# EAGLE board logmega (EAGLE 6.5.0), part 1 of 2
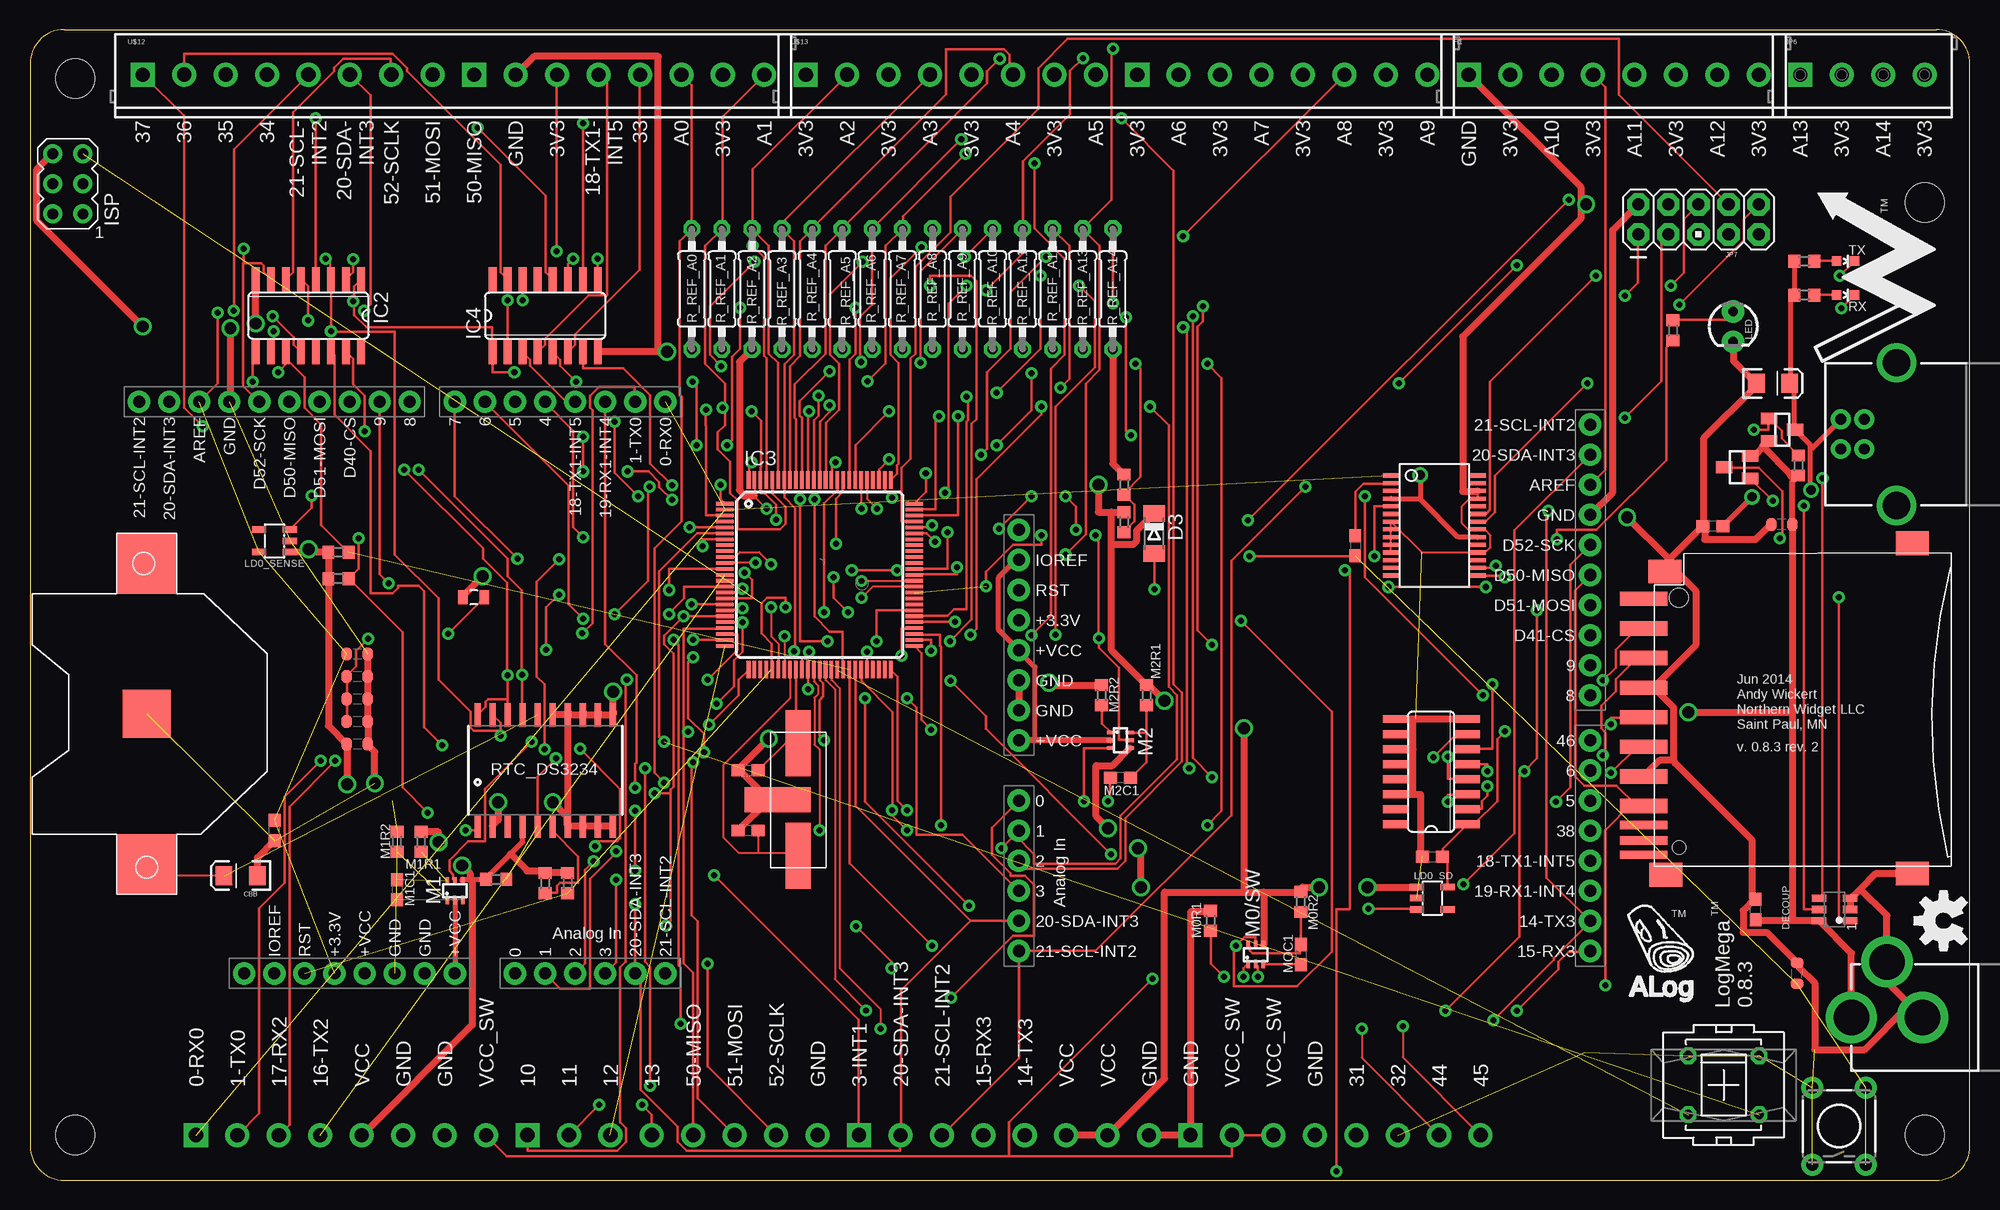
[diagram p3: board, top side]
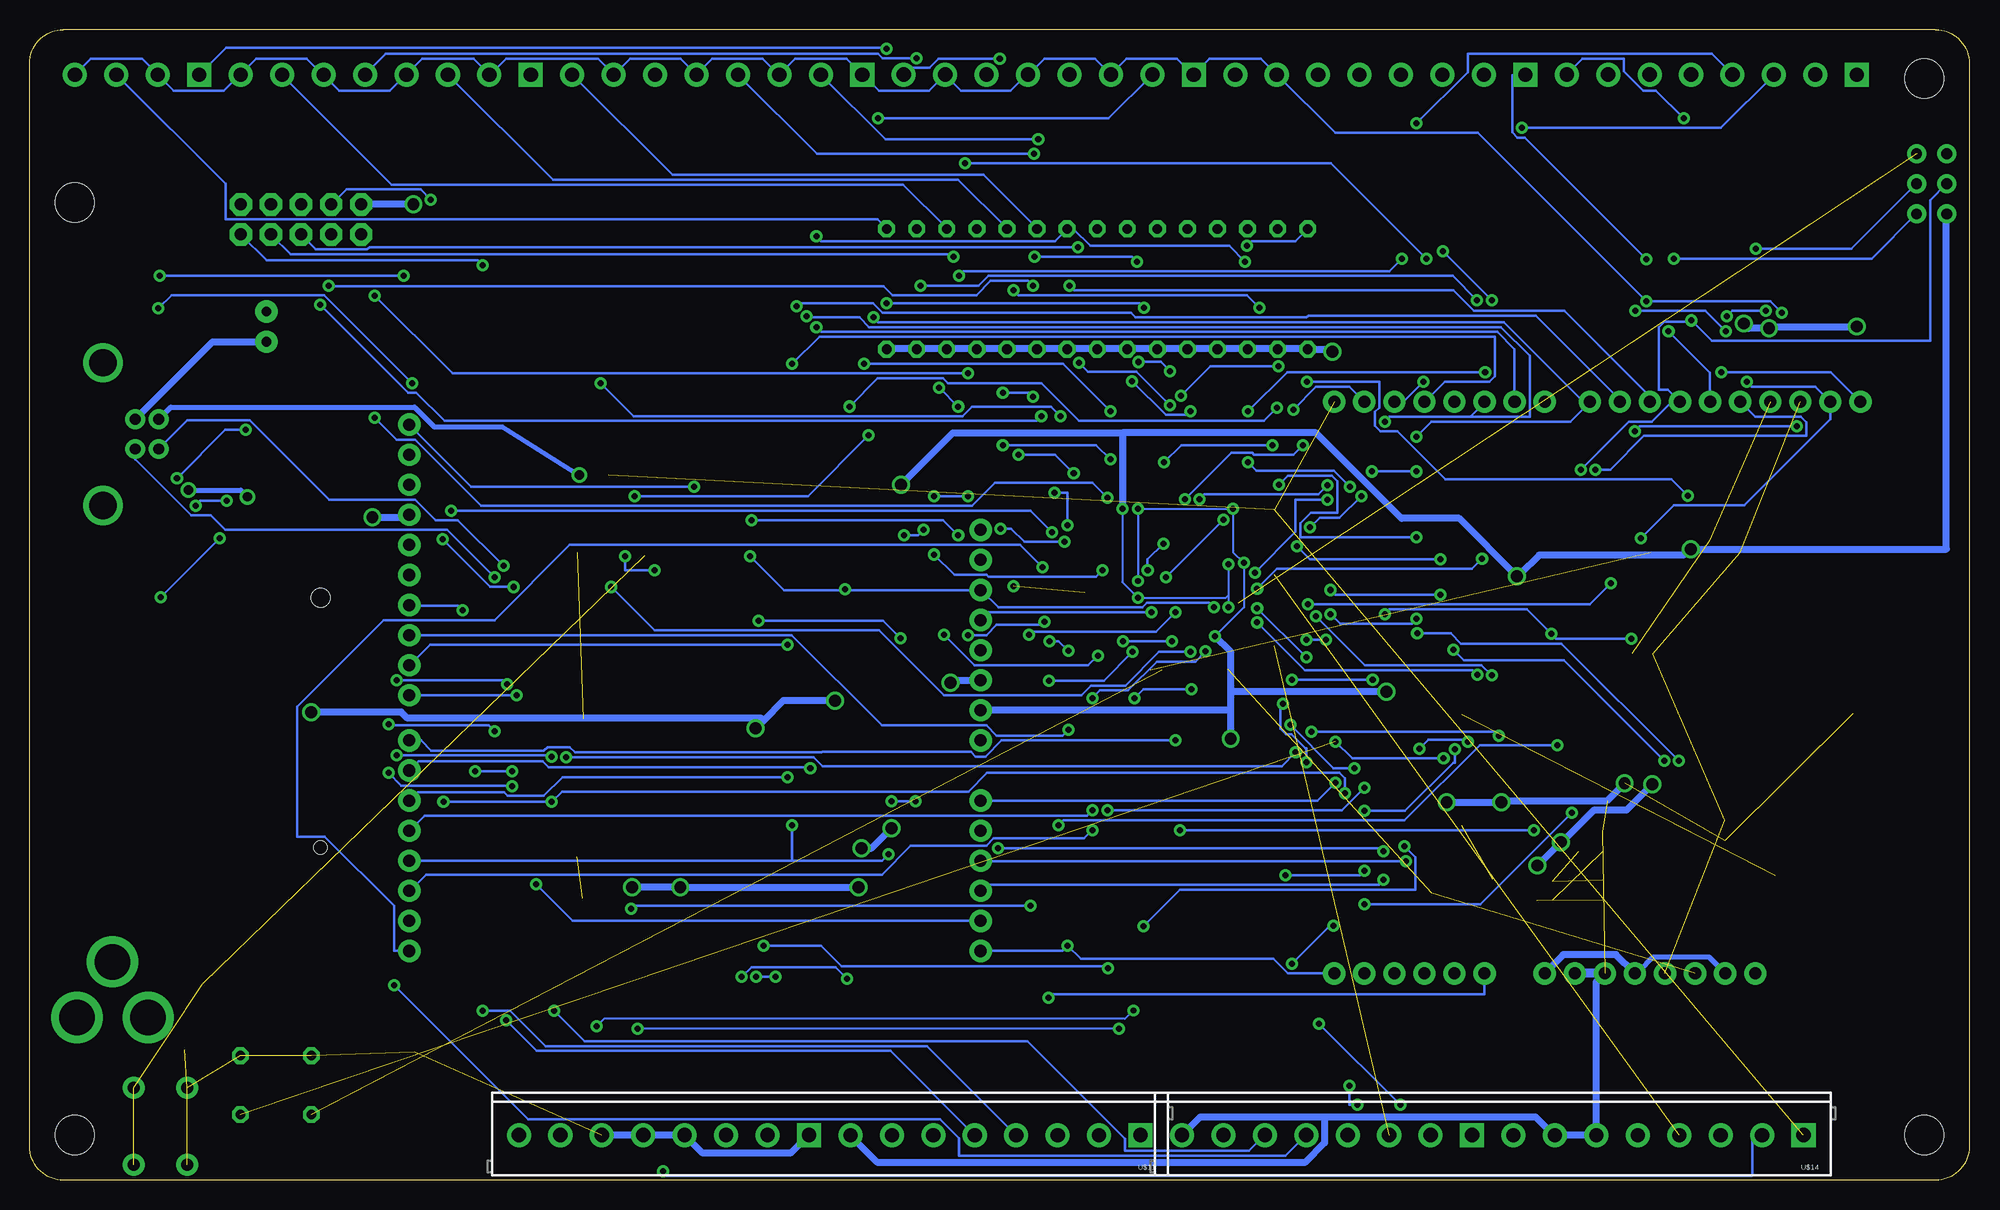
[diagram p4: board, bottom side, seen from below]

Size 163.83 x 97.16 mm. Coordinates in mm from the lower left corner, seen from the top.
Outline: 0,94.3 0,2.85 arc90 2.86,0 160.97,0 arc90 163.83,2.86 163.83,94.3 arc90 160.97,97.16 2.86,97.16 arc90 0,94.3
Copper layers (1*16): Top 0.035mm / dielectric 1.5mm / Bottom 0.035mm
Design rules "SparkFun *": minimum track width 8mil, minimum drill 20mil, track to track 6mil, track to pad 6mil, pad to pad 8mil, via to via 8mil, smd to smd 8mil, copper to edge 10mil, drill to drill 8mil, minimum pad ring 12mil, minimum via ring 10mil, stop-mask expansion 4mil, vias tented up to drill 25mil, thermal gap 10mil
Net classes: 0 default: width 0.152 mm, drill 0.5 mm, clearance 0.203 mm; 1 power: width 0.61 mm, drill 1 mm, clearance 0.203 mm; 2 gnd: width 0.61 mm, drill 1 mm, clearance 0.203 mm; 3 pwr sw: width 0.406 mm, drill 0.8 mm, clearance 0.203 mm

## Footprints (pad centres in the part's own frame; a part is rotated, then mirrored left to right if it is on the bottom)
C0603-ROUND = smd 0.898 x 1.1: 1 -0.889,0; 2 0.889,0
C0603 = smd 1.1 x 1: 1 -0.85,0; 2 0.85,0
EIA3216 = smd 1.4 x 1.6: A 1.4,0; C -1.4,0
CR2032-SMD = smd 5.08 x 5.08: +$1 -12.7,0; +$2 12.7,0 | smd 4.064 x 4.064: - 0,0
MINIMELF = smd 1.4 x 1.8: A 1.7,0; C -1.7,0
SCREWTERMINAL-3.5MM-8 = drill 1.2 pad 2.032 square: 1 0,0 | drill 1.2 pad 2.032: 2 3.5,0; 3 7,0; 4 10.5,0; 5 14,0; 6 17.5,0; 7 21,0; 8 24.5,0
TSOT23-6 = smd 0.622 x 1.22: 1 -0.95,-1.31; 2 0,-1.31; 3 0.95,-1.31; 4 0.95,1.31; 5 0,1.31; 6 -0.95,1.31
SO16 = smd 0.66 x 2.032: 1 -4.445,-3.073; 2 -3.175,-3.073; 3 -1.905,-3.073; 4 -0.635,-3.073; 5 0.635,-3.073; 6 1.905,-3.073; 7 3.175,-3.073; 8 4.445,-3.073; 9 4.445,3.073; 10 3.175,3.073; 11 1.905,3.073; 12 0.635,3.073; 13 -0.635,3.073; 14 -1.905,3.073; 15 -3.175,3.073; 16 -4.445,3.073
TQFP100 = smd 1.5 x 0.3: 1 -8,6; 2 -8,5.5; 3 -8,5; 4 -8,4.5; 5 -8,4; 6 -8,3.5; 7 -8,3; 8 -8,2.5; 9 -8,2; 10 -8,1.5; 11 -8,1; 12 -8,0.5; 13 -8,0; 14 -8,-0.5; 15 -8,-1; 16 -8,-1.5; 17 -8,-2; 18 -8,-2.5; 19 -8,-3; 20 -8,-3.5; 21 -8,-4; 22 -8,-4.5; 23 -8,-5; 24 -8,-5.5; 25 -8,-6; 51 8,-6; 52 8,-5.5; 53 8,-5; 54 8,-4.5; 55 8,-4; 56 8,-3.5; 57 8,-3; 58 8,-2.5; 59 8,-2; 60 8,-1.5; 61 8,-1; 62 8,-0.5; 63 8,0; 64 8,0.5; 65 8,1; 66 8,1.5; 67 8,2; 68 8,2.5; 69 8,3; 70 8,3.5; 71 8,4; 72 8,4.5; 73 8,5; 74 8,5.5; 75 8,6 | smd 0.3 x 1.5: 26 -6,-8; 27 -5.5,-8; 28 -5,-8; 29 -4.5,-8; 30 -4,-8; 31 -3.5,-8; 32 -3,-8; 33 -2.5,-8; 34 -2,-8; 35 -1.5,-8; 36 -1,-8; 37 -0.5,-8; 38 0,-8; 39 0.5,-8; 40 1,-8; 41 1.5,-8; 42 2,-8; 43 2.5,-8; 44 3,-8; 45 3.5,-8; 46 4,-8; 47 4.5,-8; 48 5,-8; 49 5.5,-8; 50 6,-8; 76 6,8; 77 5.5,8; 78 5,8; 79 4.5,8; 80 4,8; 81 3.5,8; 82 3,8; 83 2.5,8; 84 2,8; 85 1.5,8; 86 1,8; 87 0.5,8; 88 0,8; 89 -0.5,8; 90 -1,8; 91 -1.5,8; 92 -2,8; 93 -2.5,8; 94 -3,8; 95 -3.5,8; 96 -4,8; 97 -4.5,8; 98 -5,8; 99 -5.5,8; 100 -6,8
AVRISP = drill 0.9 pad 1.626: 1 -1.27,2.54; 2 1.27,2.54; 3 -1.27,0; 4 1.27,0; 5 -1.27,-2.54; 6 1.27,-2.54
POWER_JACK_PTH = drill 2.997 pad 4.318: GND 0,7.7; GNDBREAK 4.7,10.7; PWR 0,13.7
STAND-OFF = hole 3.302: 0,0
USB-B-PTH = drill 0.914 pad 1.676: D+ 0,1.25; D- 1.981,1.25; GND 0,-1.25; VBUS 1.981,-1.25 | drill 2.286: S1 -2.718,-6.02; S2 -2.718,6.02
SCREWTERMINAL-3.5MM-4 = drill 1.2 pad 2.032 square: 1 0,0 | drill 1.2 pad 2.032: 2 3.5,0; 3 7,0; 4 10.5,0
AVR_ICSP = drill 1.016 pad 1.88 octagon: 1 -1.27,5.08; 2 1.27,5.08; 3 -1.27,2.54; 4 1.27,2.54; 5 -1.27,0; 6 1.27,0; 7 -1.27,-2.54; 8 1.27,-2.54; 9 -1.27,-5.08; 10 1.27,-5.08
0805 = smd 0.8 x 1.2: 1 -0.9,0; 2 0.9,0
SOT23-5L = smd 0.55 x 1.2: 1 -0.95,-1.3; 2 0,-1.3; 3 0.95,-1.3; 4 0.95,1.3; 5 -0.95,1.3
LED3MM = drill 0.813 pad 1.88: A -1.27,0; K 1.27,0
SOT-363 = smd 0.3 x 0.7: 1 -0.65,-0.8; 2 0,-0.8; 3 0.65,-0.8; 4 0.65,0.8; 5 0,0.8; 6 -0.65,0.8
R0603 = smd 1 x 1.1: 1 -0.85,0; 2 0.85,0
PVA1F = drill 0.813 octagon: 1 -2.997,2.489; 2 -2.997,-2.489; 3 2.997,2.489; 4 2.997,-2.489
SUPER-SOT3 = smd 1 x 1.4: 1 -0.95,-1.1; 2 0.95,-1.1; 3 0,1.1
0207/10 = drill 0.813 octagon: 1 -5.08,0; 2 5.08,0
DS3234 = smd 0.53 x 1.98: 1 -5.715,-4.685; 2 -4.445,-4.685; 3 -3.175,-4.685; 4 -1.905,-4.685; 5 -0.635,-4.685; 6 0.635,-4.685; 7 1.905,-4.685; 8 3.175,-4.685; 9 4.445,-4.685; 10 5.715,-4.685; 11 5.715,4.685; 12 4.445,4.685; 13 3.175,4.685; 14 1.905,4.685; 15 0.635,4.685; 16 -0.635,4.685; 17 -1.905,4.685; 18 -3.175,4.685; 19 -4.445,4.685; 20 -5.715,4.685
LED-0603 = smd 0.8 x 0.8: A 0,-0.75; C 0,0.75
TACTILE-PTH = drill 1.016 pad 1.88: 1 -3.251,2.261; 2 3.251,2.261; 3 -3.251,-2.261; 4 3.251,-2.261
06132 = smd 1.2 x 4: 1 6.9,0.9; 2 4.4,0.9; 3 1.9,0.9; 4 -0.6,0.9; 5 -3.1,0.9; 6 -5.6,0.9; 7 -8.1,0.9; 9 9.4,0.9 | smd 0.7 x 4: 8 -9.7,0.9; CD -11,0.9; WP -12.2,0.9 | smd 2 x 2.8: GP -13.8,-21.8; GP2 14.1,-21.8; GP3 11.7,-0.9; GP4 -13.9,-1 | hole 1.1: -11.6,-2.1 | hole 1.6: 9.5,-2.1
SSOP28DB = smd 0.348 x 1.397: 1 -4.225,-3.656; 2 -3.575,-3.656; 3 -2.925,-3.656; 4 -2.275,-3.656; 5 -1.625,-3.656; 6 -0.975,-3.656; 7 -0.325,-3.656; 8 0.325,-3.656; 9 0.975,-3.656; 10 1.625,-3.656; 11 2.275,-3.656; 12 2.925,-3.656; 13 3.575,-3.656; 14 4.225,-3.656; 15 4.225,3.656; 16 3.575,3.656; 17 2.925,3.656; 18 2.275,3.656; 19 1.625,3.656; 20 0.975,3.656; 21 0.325,3.656; 22 -0.325,3.656; 23 -0.975,3.656; 24 -1.625,3.656; 25 -2.275,3.656; 26 -2.925,3.656; 27 -3.575,3.656; 28 -4.225,3.656
ARDUINO_SHIELD_PO_BL2 = drill 1.016 pad 1.88: 3.3V 50.8,26.67; 5V 50.8,29.21; A0 50.8,41.91; A1 50.8,44.45; A2 50.8,46.99; A3 50.8,49.53; A4 50.8,52.07; A5 50.8,54.61; AREF 2.54,15.24; D2 2.54,49.53; D3 2.54,46.99; D4 2.54,44.45; D5 2.54,41.91; D6 2.54,39.37; D7 2.54,36.83; D8 2.54,33.02; D9 2.54,30.48; D10 2.54,27.94; D11 2.54,25.4; D12 2.54,22.86; D13 2.54,20.32; GND@0 50.8,31.75; GND@1 50.8,34.29; GND@2 2.54,17.78; IOREF 50.8,21.59; NC 50.8,19.05; RES 50.8,24.13; RX 2.54,54.61; SCL 2.54,10.16; SDA 2.54,12.7; TX 2.54,52.07; VIN 50.8,36.83
AT49 = smd 2.1 x 5.6: GND 7.55,-0.7 | smd 5.6 x 2.1: IO1 2.8,1.05; IO2 12.3,1.05
ARDUINO_SHIELD_PO_BL1 = drill 1.016 pad 1.88: 3.3V 50.8,26.67; 5V 50.8,29.21; A0 50.8,41.91; A1 50.8,44.45; A2 50.8,46.99; A3 50.8,49.53; A4 50.8,52.07; A5 50.8,54.61; AREF 2.54,15.24; D2 2.54,49.53; D3 2.54,46.99; D4 2.54,44.45; D5 2.54,41.91; D6 2.54,39.37; D7 2.54,36.83; D8 2.54,33.02; D9 2.54,30.48; D10 2.54,27.94; D11 2.54,25.4; D12 2.54,22.86; D13 2.54,20.32; GND@0 50.8,31.75; GND@1 50.8,34.29; GND@2 2.54,17.78; IOREF 50.8,21.59; NC 50.8,19.05; RES 50.8,24.13; RX 2.54,54.61; SCL 2.54,10.16; SDA 2.54,12.7; TX 2.54,52.07; VIN 50.8,36.83
M16-SCREW-3.5MM = drill 1.2 pad 2.032 square: 1 0,0; 9 28,0 | drill 1.2 pad 2.032: 2 3.5,0.007; 3 7,0.007; 4 10.5,0.007; 5 14,0.007; 6 17.5,0.007; 7 21,0.007; 8 24.5,0.007; 10 31.5,0; 11 35,0; 12 38.5,0; 13 42,0; 14 45.5,0; 15 49,0; 16 52.5,0

## Placement (x,y rotation side)
C1  22pF  [C0603-ROUND]  149.22,17.46 90 top
C3  0.1uF  [C0603-ROUND]  27.62,44.45 0 top
C4  0.1uF  [C0603-ROUND]  27.62,42.55 0 top
C5  0.1uF  [C0603-ROUND]  27.62,40.64 0 top
C6  0.1uF  [C0603-ROUND]  27.62,38.73 0 top
C11  0.1uF  [C0603-ROUND]  27.62,36.83 180 top
C_LDO_SD  >=2.2uF  [C0603]  118.43,27.3 0 top
C_LDO_SENSE  >=2.2uF  [C0603]  20.64,29.53 90 top
C_RESET  0.1uF  [C0603]  111.91,53.56 270 top
CBB  10uF  [EIA3216]  17.78,25.72 180 top
CLOCK_BATT  3V Backup Battery  [CR2032-SMD]  9.84,39.37 90 top
COUT  1uF  [C0603-ROUND]  147.93,55.37 180 top
CX0  33pF  [C0603]  60.64,29.53 0 top
CX1  33pF  [C0603]  60.64,34.61 0 top
D3  CD1206-S01575  [MINIMELF]  94.93,54.61 270 top
DECOUP  >=1uF  [C0603]  145.73,22.86 90 top
H1  [SCREWTERMINAL-3.5MM-8]  121.5,93.35 0 top
IC1  LTC4412  [TSOT23-6]  152.4,22.86 90 top
IC2  4050D  [SO16]  23.5,73 180 top
IC3  ATMEGA2560-16AU  [TQFP100]  66.67,51.12 0 top
IC4  4050D  [SO16]  43.5,73 0 top
ISP  AVRISP-6  [AVRISP]  3.17,84.14 180 top
J1  POWER_JACKPTH  [POWER_JACK_PTH]  167.53,13.74 90 top
JP1  STAND-OFF  [STAND-OFF]  3.81,3.81 0 top
JP2  STAND-OFF  [STAND-OFF]  160.02,82.55 90 top
JP3  STAND-OFF  [STAND-OFF]  160.02,3.81 90 top
JP4  STAND-OFF  [STAND-OFF]  3.81,93.03 0 top
JP5  USB-B  [USB-B-PTH]  154.92,62.99 180 top
JP6  [SCREWTERMINAL-3.5MM-4]  149.5,93.35 0 top
JP7  M05X2PTH  [AVR_ICSP]  140.91,81.13 90 top
L_LPF  10uH  [0805]  37.47,49.21 180 top
LD0_SD  LP2985  [SOT23-5L]  118.43,23.81 270 top
LD0_SENSE  LP2985  [SOT23-5L]  20.64,53.98 90 top
LED  [LED3MM]  143.83,72.07 270 top
LOGO1  OSHW-LOGOM  [OSHW-LOGO-M]  161.61,21.91 90 top
LSHIFT  4050D  [SO16]  118.33,34.49 90 top
M0/SW  FDG6342L  [SOT-363]  103.5,19.05 0 top
M0R1  10K  [R0603]  99.69,21.91 270 top
M0R2  10K  [R0603]  107.31,23.5 270 top
M1  FDG6342L  [SOT-363]  35.88,24.45 0 top
M1C1  0.1uF  [C0603]  30.99,24.54 270 top
M1R1  10K  [R0603]  33.02,28.57 270 top
M1R2  10K  [R0603]  30.99,28.57 270 top
M2  FDG6342L  [SOT-363]  92.08,37.15 270 top
M2C1  0.1uF  [C0603]  92.08,33.97 180 top
M2R1  10K  [R0603]  94.3,40.96 270 top
M2R2  10K  [R0603]  90.49,40.96 270 top
MANUAL_LOG  Log Now  [PVA1F]  143.03,8.03 180 top
MOC1  0.1uF  [C0603]  107.31,19.05 270 top
Q1  FDN360P  [SUPER-SOT3]  144.17,60.2 90 top
Q2  FDN360P  [SUPER-SOT3]  147.98,63.37 270 top
R_LED  330  [R0603]  138.75,71.75 90 top
R_REF_A0  Therm  [0207/10]  55.88,75.25 90 top
R_REF_A1  [0207/10]  58.42,75.25 90 top
R_REF_A2  [0207/10]  60.96,75.25 90 top
R_REF_A3  [0207/10]  63.5,75.25 90 top
R_REF_A4  [0207/10]  66.04,75.25 90 top
R_REF_A5  [0207/10]  68.58,75.25 90 top
R_REF_A6  [0207/10]  71.12,75.25 90 top
R_REF_A7  [0207/10]  73.66,75.25 90 top
R_REF_A8  Therm  [0207/10]  76.2,75.25 90 top
R_REF_A9  [0207/10]  78.74,75.25 90 top
R_REF_A10  [0207/10]  81.28,75.25 90 top
R_REF_A11  [0207/10]  83.82,75.25 90 top
R_REF_A12  [0207/10]  86.36,75.25 90 top
R_REF_A13  [0207/10]  88.9,75.25 90 top
R_REF_A14  [0207/10]  91.44,75.25 90 top
R_RESET  10K  [R0603]  45.4,25.08 90 top
R_RXLED  1K  [R0603]  149.84,74.74 0 top
R_TXLED  1K  [R0603]  149.84,77.6 0 top
RSTAT  470k  [R0603]  149.35,60.35 270 top
RTC_DS3234  DS3234  [DS3234]  43.5,34.61 0 top
RTC_INT_PU  10K  [R0603]  39.37,25.4 180 top
RTC_RST_PU  10K  [R0603]  43.5,25.08 90 top
RX  [LED-0603]  153.33,74.74 270 top
S2  Reset  [TACTILE-PTH]  152.77,4.56 90 top
SCL_PU  10K  [R0603]  26.04,53.02 180 top
SD  SDMMC06132  [06132]  137.16,39.69 90 top
SDA_PU  10K  [R0603]  26.04,50.8 180 top
TX  [LED-0603]  153.33,77.6 270 top
U1  FT232RL  [SSOP28DB]  118.6,55.28 270 top
U$1  NWLOGO  [NWLOGO]  156.21,76.2 90 top
U$2  ALOG_LOGO_V1_5.5MM  [ALOG_LOGO_V1_SMALL]  137.79,20.32 0 top
U$7  ARDUINO_SHIELD_BIGLOG_2  [ARDUINO_SHIELD_PO_BL2]  134.3,73.96 180 top
U$8  XTAL_ABLSG  [AT49]  63.82,39.69 270 top
U$9  ARDUINO_SHIELD_BIGLOG_1  [ARDUINO_SHIELD_PO_BL1]  -0.97,68.26 270 top
U$11  M16-SCREW-3.5MM  [M16-SCREW-3.5MM]  70,3.81 180 bottom
U$12  M16-SCREW-3.5MM  [M16-SCREW-3.5MM]  9.5,93.35 0 top
U$13  M16-SCREW-3.5MM  [M16-SCREW-3.5MM]  65.5,93.35 0 top
U$14  M16-SCREW-3.5MM  [M16-SCREW-3.5MM]  14,3.81 180 bottom
USBD0  0.1uF  [C0603]  142.11,55.22 180 top
USBD1  10uF  [EIA3216]  147.19,67.29 0 top
VCC_VDIV_1  1M  [R0603]  92.39,55.56 90 top
VCC_VDIV_2  1M  [R0603]  92.39,58.74 270 top